# EAGLE design power_converter (EAGLE 9.0.0)
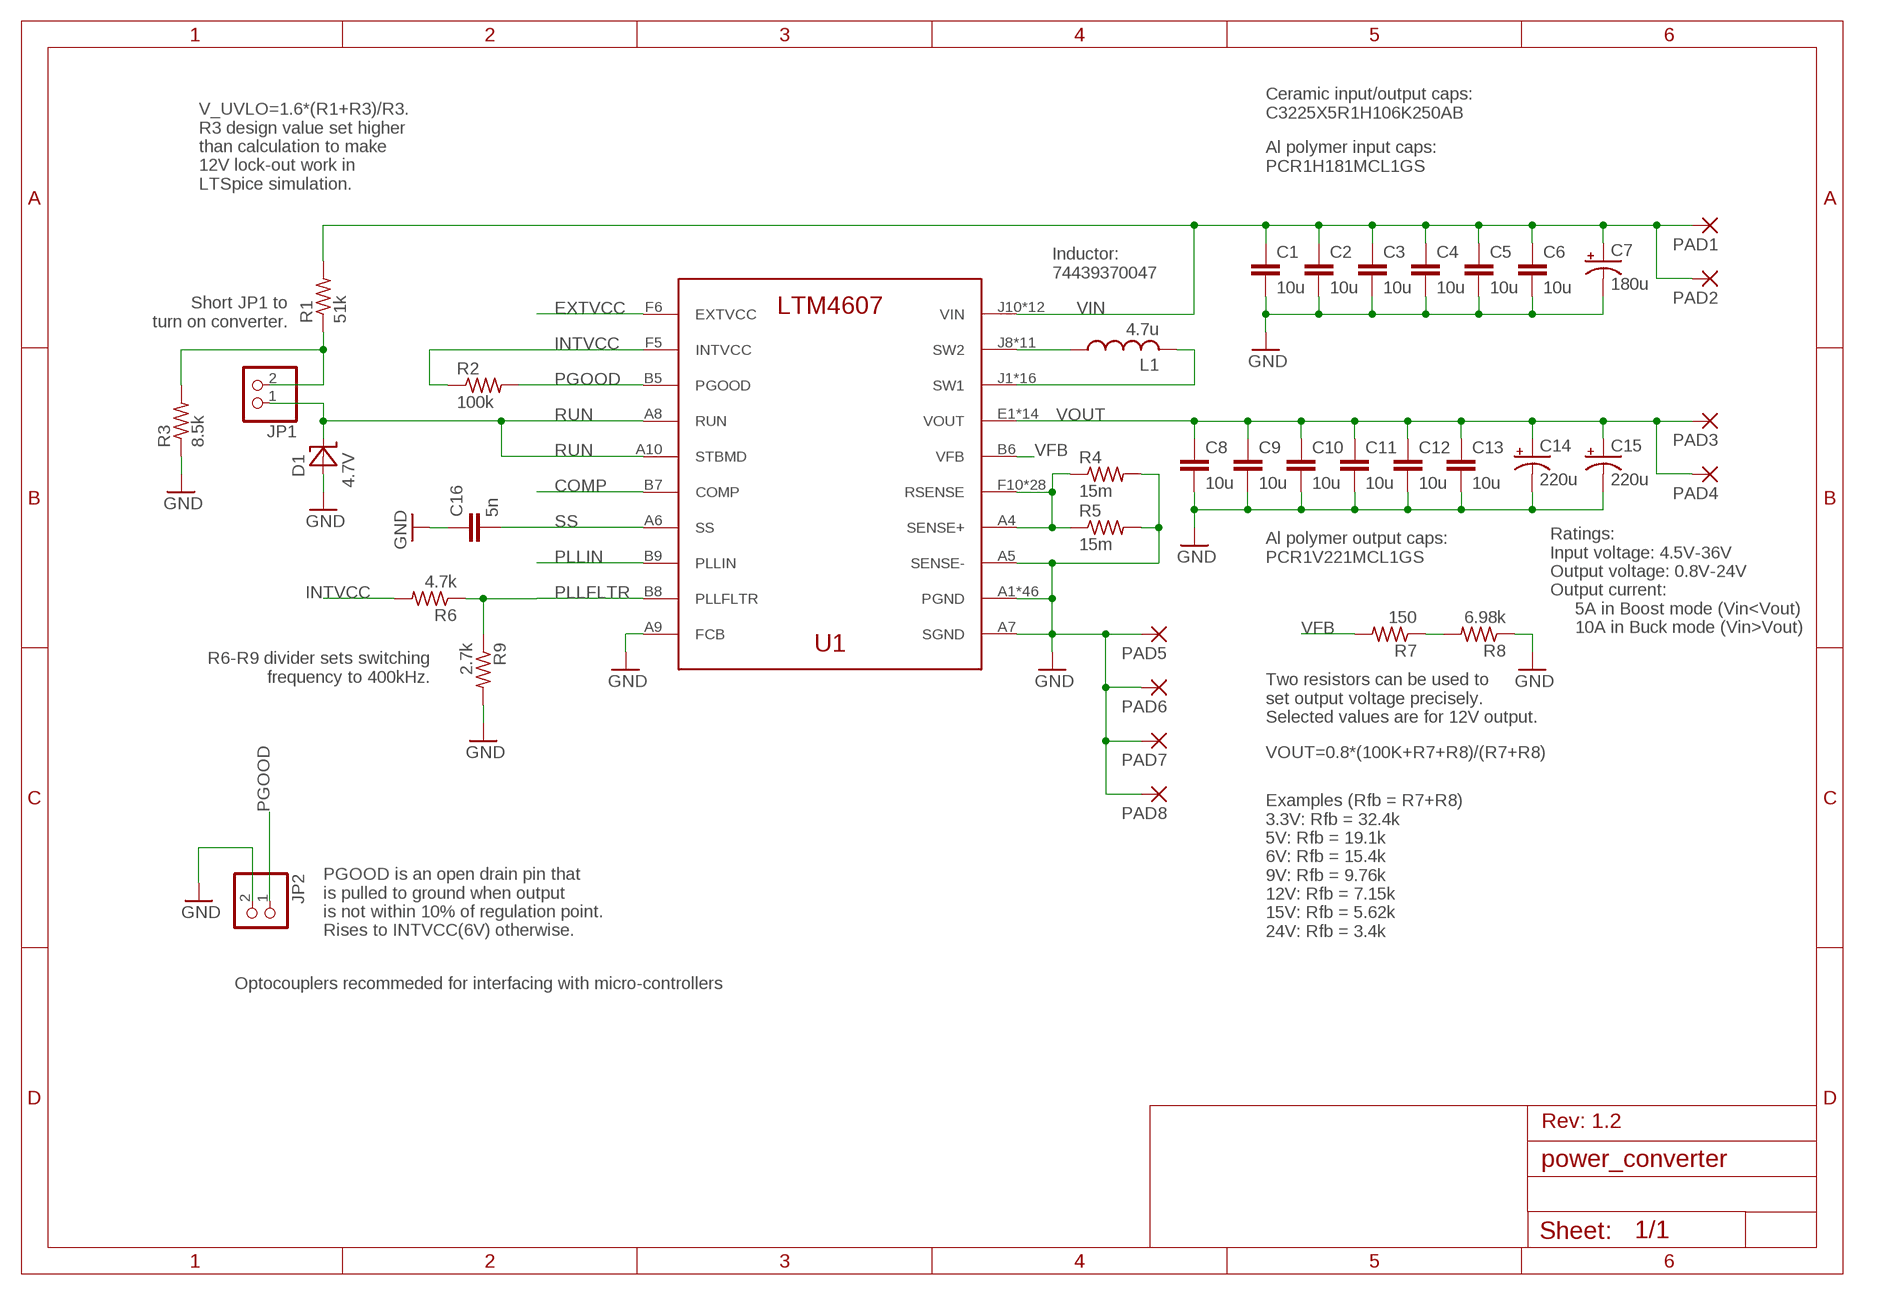
[diagram p0: schematic, sheet 1]

## Parts
C1  10u  C-EUC1210  [C1210]
C2  10u  C-EUC1210  [C1210]
C3  10u  C-EUC1210  [C1210]
C4  10u  C-EUC1210  [C1210]
C5  10u  C-EUC1210  [C1210]
C6  10u  C-EUC1210  [C1210]
C7  180u  PCR1H181MCL1GS  [PCR1H181MCL1GS]
C8  10u  C-EUC1210  [C1210]
C9  10u  C-EUC1210  [C1210]
C10  10u  C-EUC1210  [C1210]
C11  10u  C-EUC1210  [C1210]
C12  10u  C-EUC1210  [C1210]
C13  10u  C-EUC1210  [C1210]
C14  220u  PCR1V221MCL1GS  [PCR1V221MCL1GS]
C15  220u  PCR1V221MCL1GS  [PCR1V221MCL1GS]
C16  5n  C-EUC0603  [C0603]
D1  4.7V  BZX84C4V7LT1G  [SOT23]
JP1  PINHD-1X02_2.54-SMD  [1X02SMD]
JP2  PINHD-1X02_2.54-SMD  [1X02SMD]
L1  4.7u  74439370047  [74439370047]
PAD1  3,81/1,5  [3,81/1,5]
PAD2  3,81/1,5  [3,81/1,5]
PAD3  3,81/1,5  [3,81/1,5]
PAD4  3,81/1,5  [3,81/1,5]
PAD5  3,81/1,5  [3,81/1,5]
PAD6  3,81/1,5  [3,81/1,5]
PAD7  3,81/1,5  [3,81/1,5]
PAD8  3,81/1,5  [3,81/1,5]
R1  51k  R-US_R0603  [R0603]
R2  100k  R-US_R0603  [R0603]
R3  8.5k  R-US_R0603  [R0603]
R4  15m  R-US_R1206  [R1206]
R5  15m  R-US_R1206  [R1206]
R6  4.7k  R-US_R0603  [R0603]
R7  150  R-US_R0603  [R0603]
R8  6.98k  R-US_R0603  [R0603]
R9  2.7k  R-US_R0603  [R0603]
U1  LTM4607EVPBF  [LGA-141]

## Nets
COMP: U1.B7(COMP)
EXTVCC: U1.F6(EXTVCC)
GND: C1.2 C2.2 C3.2 C4.2 C5.2 C6.2 C7.NEG(-) C8.2 C9.2 C10.2 C11.2 C12.2 C13.2 C14.NEG(-) C15.NEG(-) C16.1 D1.1(A) JP2.2 PAD5.1(P) PAD6.1(P) PAD7.1(P) PAD8.1(P) R3.1 R4.2 R5.2 R8.1 R9.2 U1.A1(PGND) U1.A2(PGND) U1.A3(PGND) U1.A5(SENSE-) U1.A7(SGND) U1.A9(FCB) U1.A11(PGND) U1.A12(PGND) U1.B1(PGND) U1.B2(PGND) U1.B3(PGND) U1.B4(PGND) U1.B10(PGND) U1.B11(PGND) U1.B12(PGND) U1.C1(PGND) U1.C2(PGND) U1.C3(PGND) U1.C4(PGND) U1.C5(PGND) U1.C6(PGND) U1.C7(PGND) U1.C8(PGND) U1.C9(PGND) U1.C10(PGND) U1.C11(PGND) U1.C12(PGND) U1.D1(PGND) U1.D2(PGND) U1.D3(PGND) U1.D4(PGND) U1.D5(PGND) U1.D6(PGND) U1.D7(PGND) U1.D8(PGND) U1.D9(PGND) U1.D10(PGND) U1.D11(PGND) U1.D12(PGND) U1.E3(PGND) U1.E4(PGND) U1.E5(PGND) U1.E6(PGND) U1.E7(PGND) U1.E8(PGND) U1.E9(PGND) U1.E10(PGND) U1.E11(PGND) U1.E12(PGND)
INTVCC: R2.1 R6.2 U1.F5(INTVCC)
N$1: R7.1 R8.2
N$2: JP1.2 R1.1 R3.2
PGOOD: JP2.1 R2.2 U1.B5(PGOOD)
PLLFLTR: R6.1 R9.1 U1.B8(PLLFLTR)
PLLIN: U1.B9(PLLIN)
RSENSE: R4.1 R5.1 U1.A4(SENSE+) U1.F10(RSENSE) U1.F11(RSENSE) U1.F12(RSENSE) U1.G5(RSENSE) U1.G6(RSENSE) U1.G7(RSENSE) U1.G8(RSENSE) U1.G9(RSENSE) U1.G10(RSENSE) U1.G11(RSENSE) U1.G12(RSENSE) U1.H5(RSENSE) U1.H6(RSENSE) U1.H7(RSENSE) U1.H8(RSENSE) U1.H9(RSENSE) U1.H10(RSENSE) U1.H11(RSENSE) U1.H12(RSENSE) U1.J5(RSENSE) U1.J6(RSENSE) U1.J7(RSENSE) U1.K5(RSENSE) U1.K6(RSENSE) U1.L5(RSENSE) U1.L6(RSENSE) U1.M5(RSENSE) U1.M6(RSENSE)
RUN: D1.3(C) JP1.1 U1.A8(RUN) U1.A10(STBMD)
SS: C16.2 U1.A6(SS)
SW1: L1.M2 U1.J1(SW1) U1.J2(SW1) U1.J3(SW1) U1.J4(SW1) U1.K1(SW1) U1.K2(SW1) U1.K3(SW1) U1.K4(SW1) U1.L1(SW1) U1.L2(SW1) U1.L3(SW1) U1.L4(SW1) U1.M1(SW1) U1.M2(SW1) U1.M3(SW1) U1.M4(SW1)
SW2: L1.M1 U1.J8(SW2) U1.J9(SW2) U1.K7(SW2) U1.K8(SW2) U1.K9(SW2) U1.L7(SW2) U1.L8(SW2) U1.L9(SW2) U1.M7(SW2) U1.M8(SW2) U1.M9(SW2)
VFB: R7.2 U1.B6(VFB)
VIN: C1.1 C2.1 C3.1 C4.1 C5.1 C6.1 C7.POS(+) PAD1.1(P) PAD2.1(P) R1.2 U1.J10(VIN) U1.J11(VIN) U1.J12(VIN) U1.K10(VIN) U1.K11(VIN) U1.K12(VIN) U1.L10(VIN) U1.L11(VIN) U1.L12(VIN) U1.M10(VIN) U1.M11(VIN) U1.M12(VIN)
VOUT: C8.1 C9.1 C10.1 C11.1 C12.1 C13.1 C14.POS(+) C15.POS(+) PAD3.1(P) PAD4.1(P) U1.E1(VOUT) U1.E2(VOUT) U1.F1(VOUT) U1.F2(VOUT) U1.F3(VOUT) U1.F4(VOUT) U1.G1(VOUT) U1.G2(VOUT) U1.G3(VOUT) U1.G4(VOUT) U1.H1(VOUT) U1.H2(VOUT) U1.H3(VOUT) U1.H4(VOUT)

## Notes on the sheet
- Ceramic input/output caps:
  C3225X5R1H106K250AB
- Al polymer input caps:
  PCR1H181MCL1GS
- V_UVLO=1.6*(R1+R3)/R3.
  R3 design value set higher 
  than calculation to make
  12V lock-out work in
  LTSpice simulation.
- Inductor:
  74439370047
- Short JP1 to
  turn on converter.
- Ratings:
  Input voltage: 4.5V-36V
  Output voltage: 0.8V-24V
  Output current:
       5A in Boost mode (Vin<Vout)
       10A in Buck mode (Vin>Vout)
- Al polymer output caps:
  PCR1V221MCL1GS
- R6-R9 divider sets switching
  frequency to 400kHz.
- Two resistors can be used to
  set output voltage precisely.
  Selected values are for 12V output.
- VOUT=0.8*(100K+R7+R8)/(R7+R8)
- Examples (Rfb = R7+R8)
  3.3V: Rfb = 32.4k
  5V: Rfb = 19.1k
  6V: Rfb = 15.4k
  9V: Rfb = 9.76k
  12V: Rfb = 7.15k
  15V: Rfb = 5.62k
  24V: Rfb = 3.4k
- PGOOD is an open drain pin that
  is pulled to ground when output
  is not within 10% of regulation point.
  Rises to INTVCC(6V) otherwise.
- Optocouplers recommeded for interfacing with micro-controllers
- Rev: 1.2

## Library data of the parts
C1-C6 C8-C13 C16 = rcl:C-EU: CAPACITOR, European symbol; SPICEPREFIX: C
C7 = LTM4607:PCR1H181MCL1GS
C14 C15 = LTM4607:PCR1V221MCL1GS
D1 = LTM4607:BZX84C4V7LT1G
JP1 JP2 = pinhead-2:PINHD-1X02: PIN HEADER
L1 = LTM4607:74439370047
PAD1-PAD8 = LTM4607:3,81/1,5: THROUGH-HOLE PAD
R1-R9 = rcl:R-US_: RESISTOR, American symbol; SPICEPREFIX: R
U1 = LTM4607:LTM4607EVPBF; MANUFACTURER_PART_NUMBER: LTM4607EV#PBF; VENDOR: Linear Technology

## Board
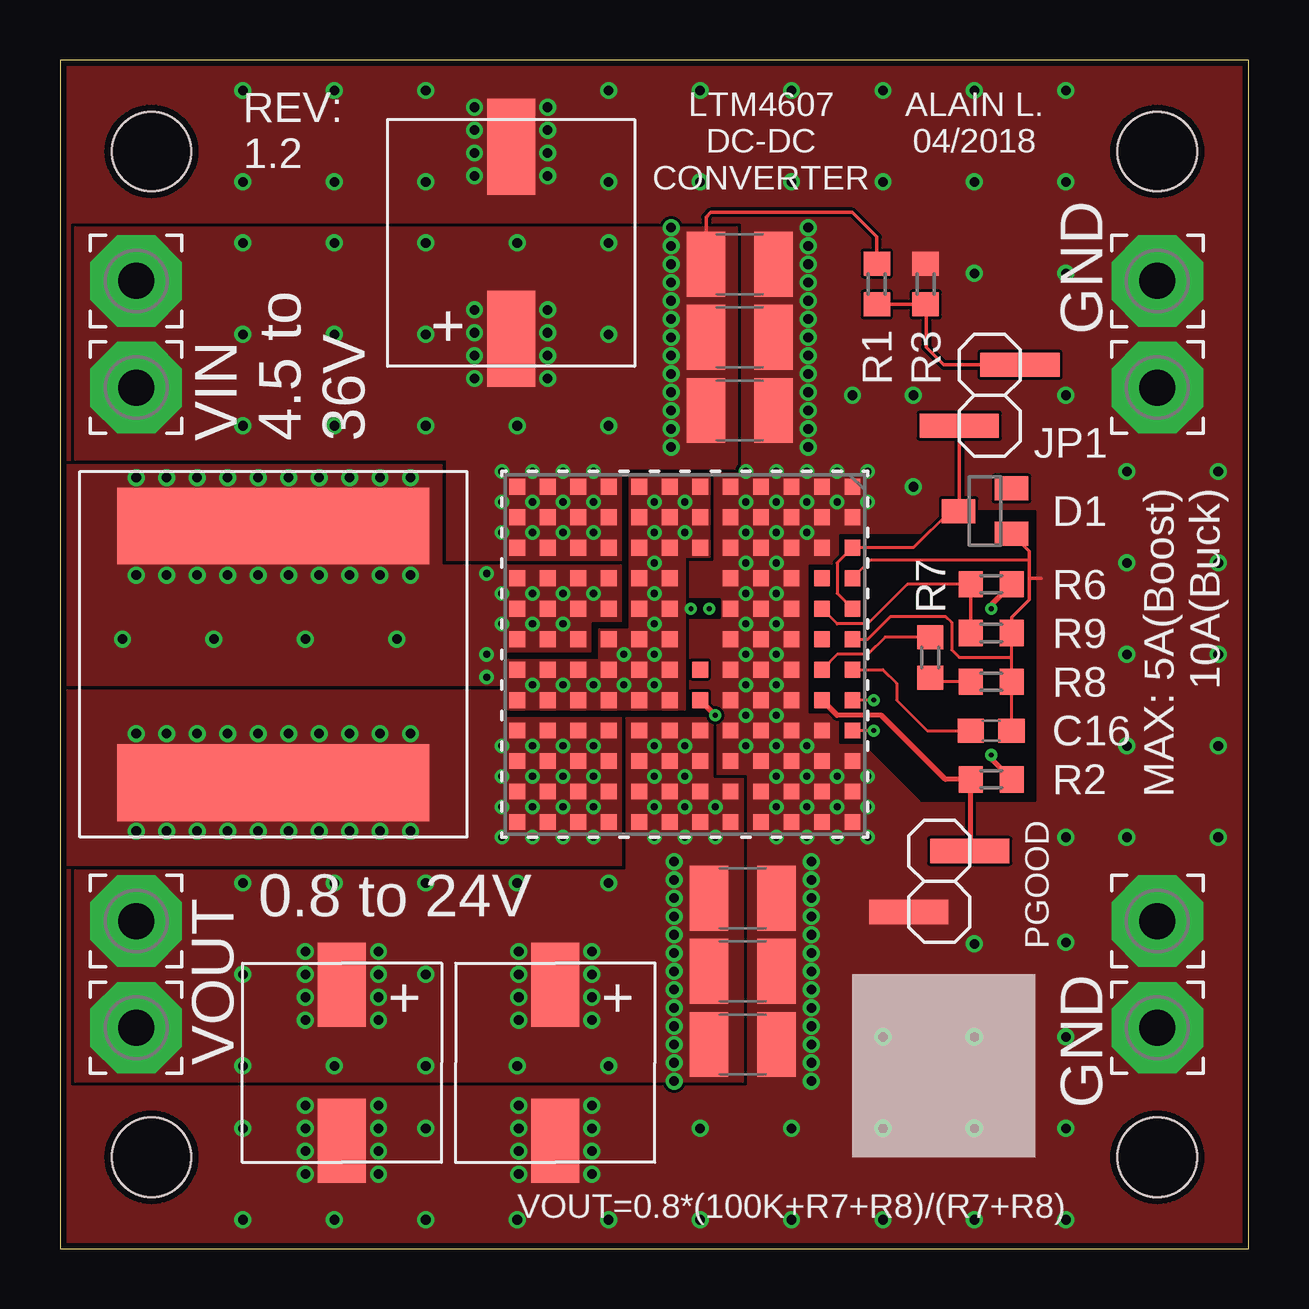
[diagram p1: board, top side]
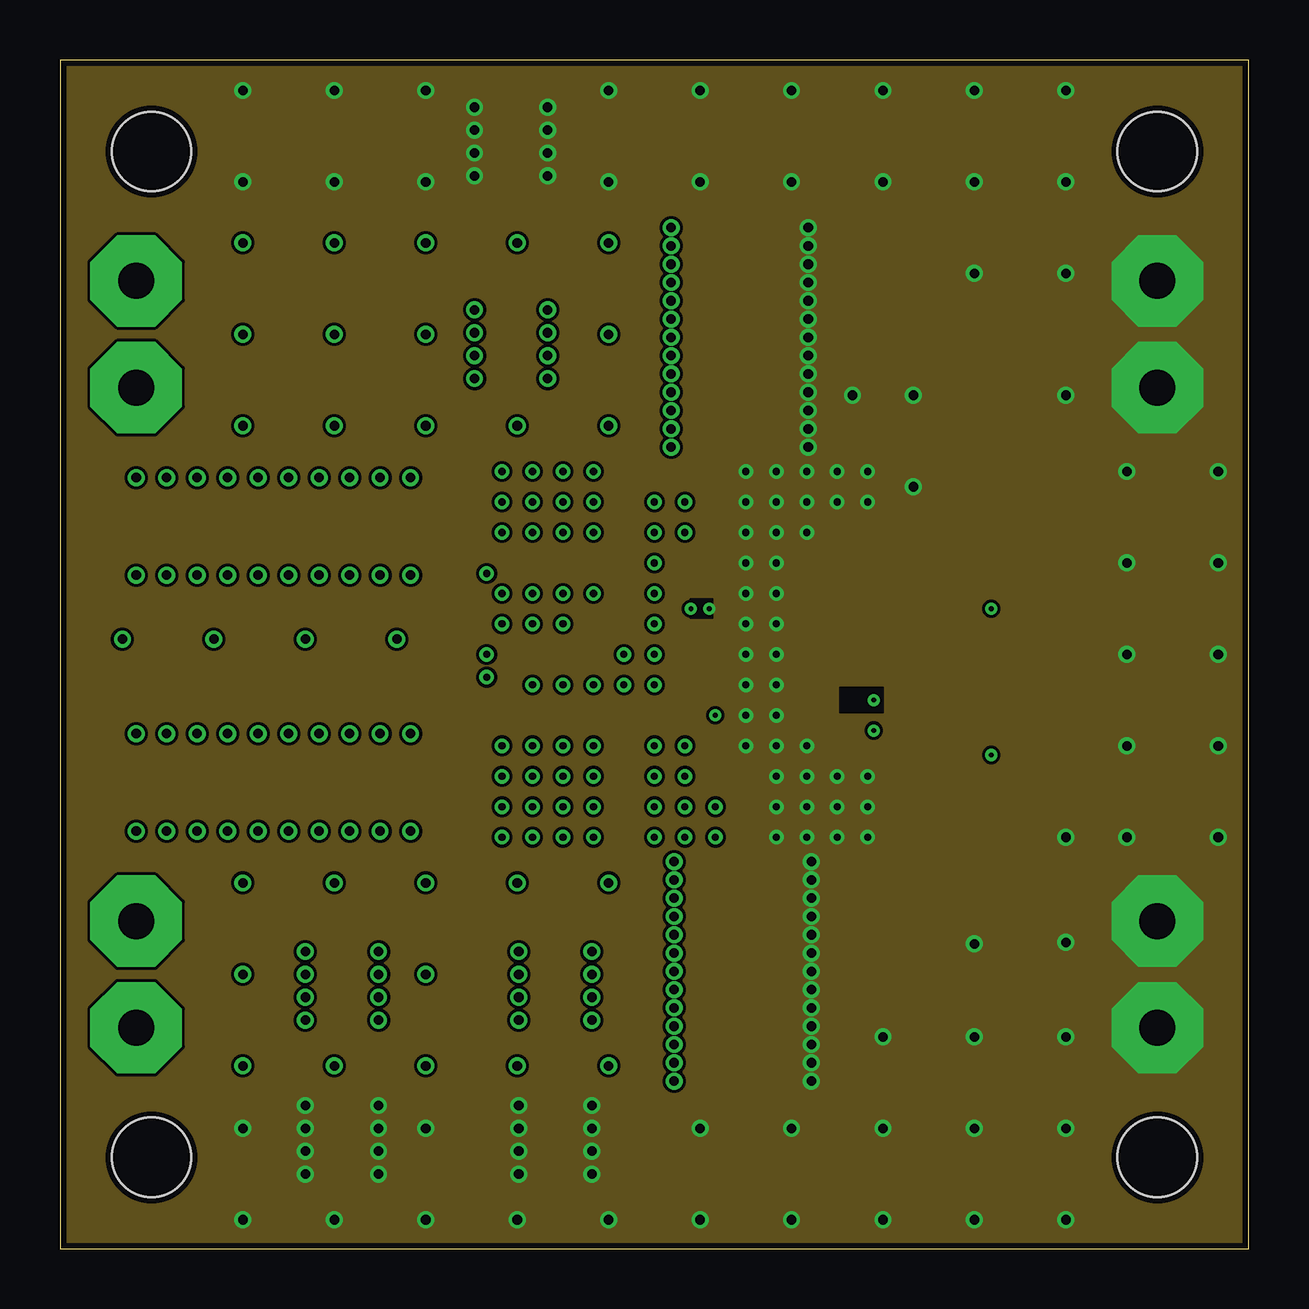
[diagram p2: board, inner layer Route2]
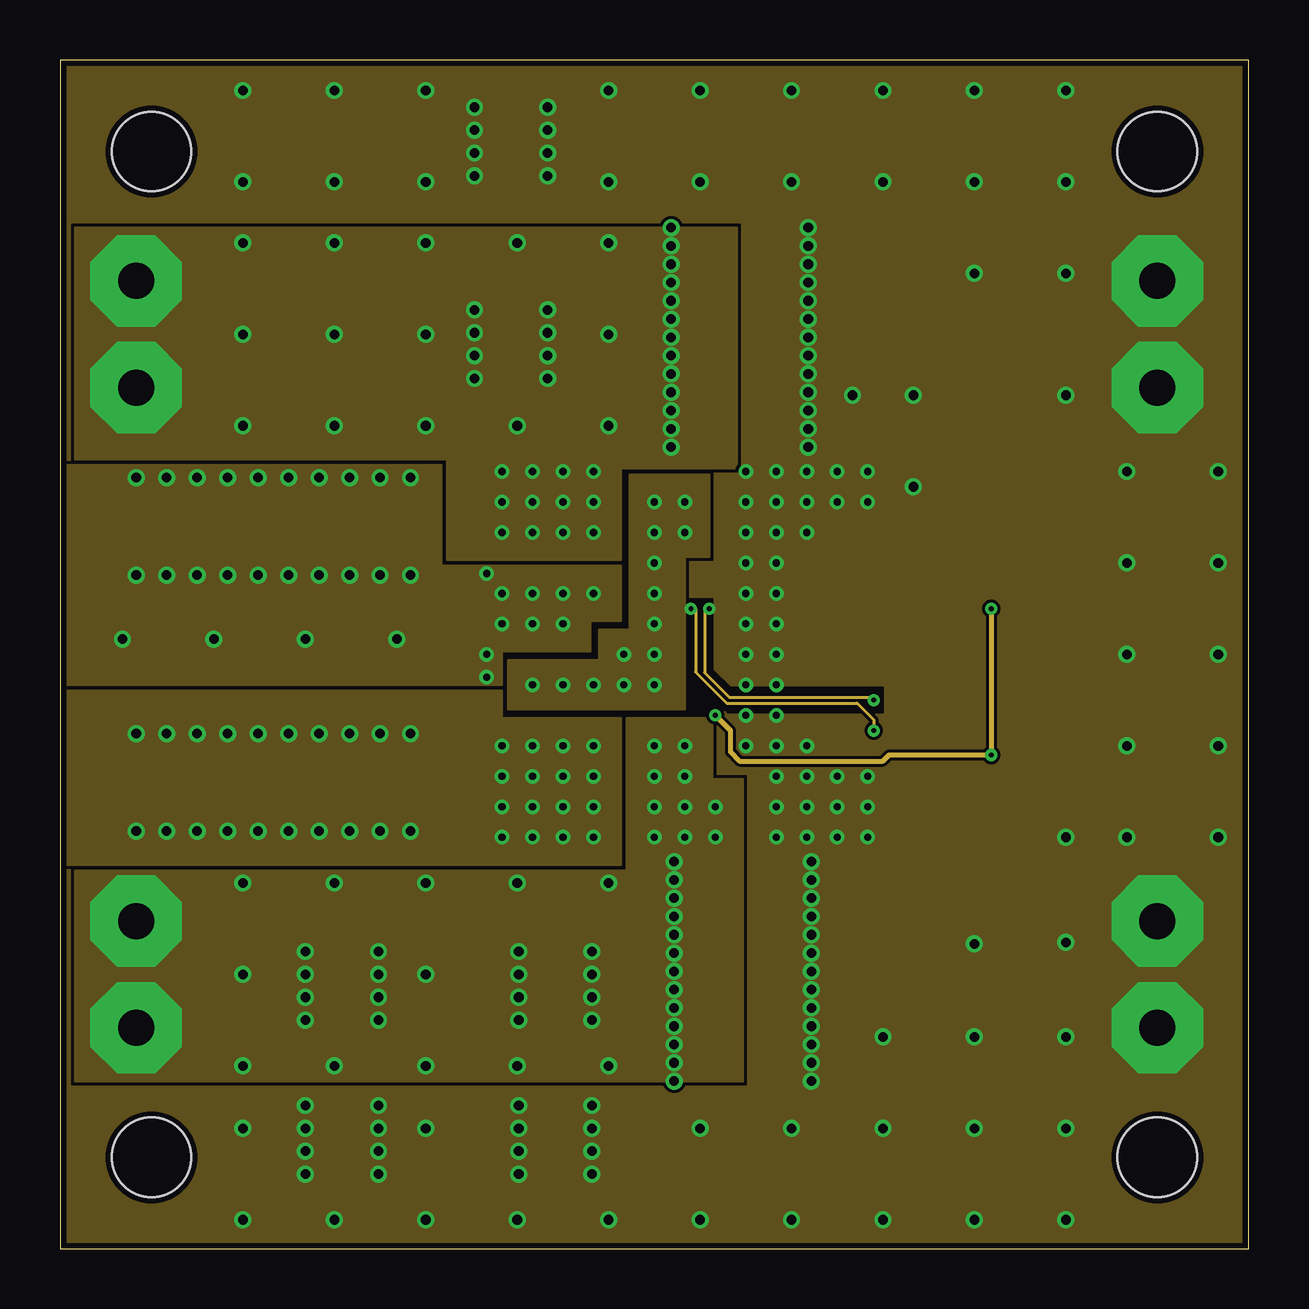
[diagram p3: board, inner layer Route15]
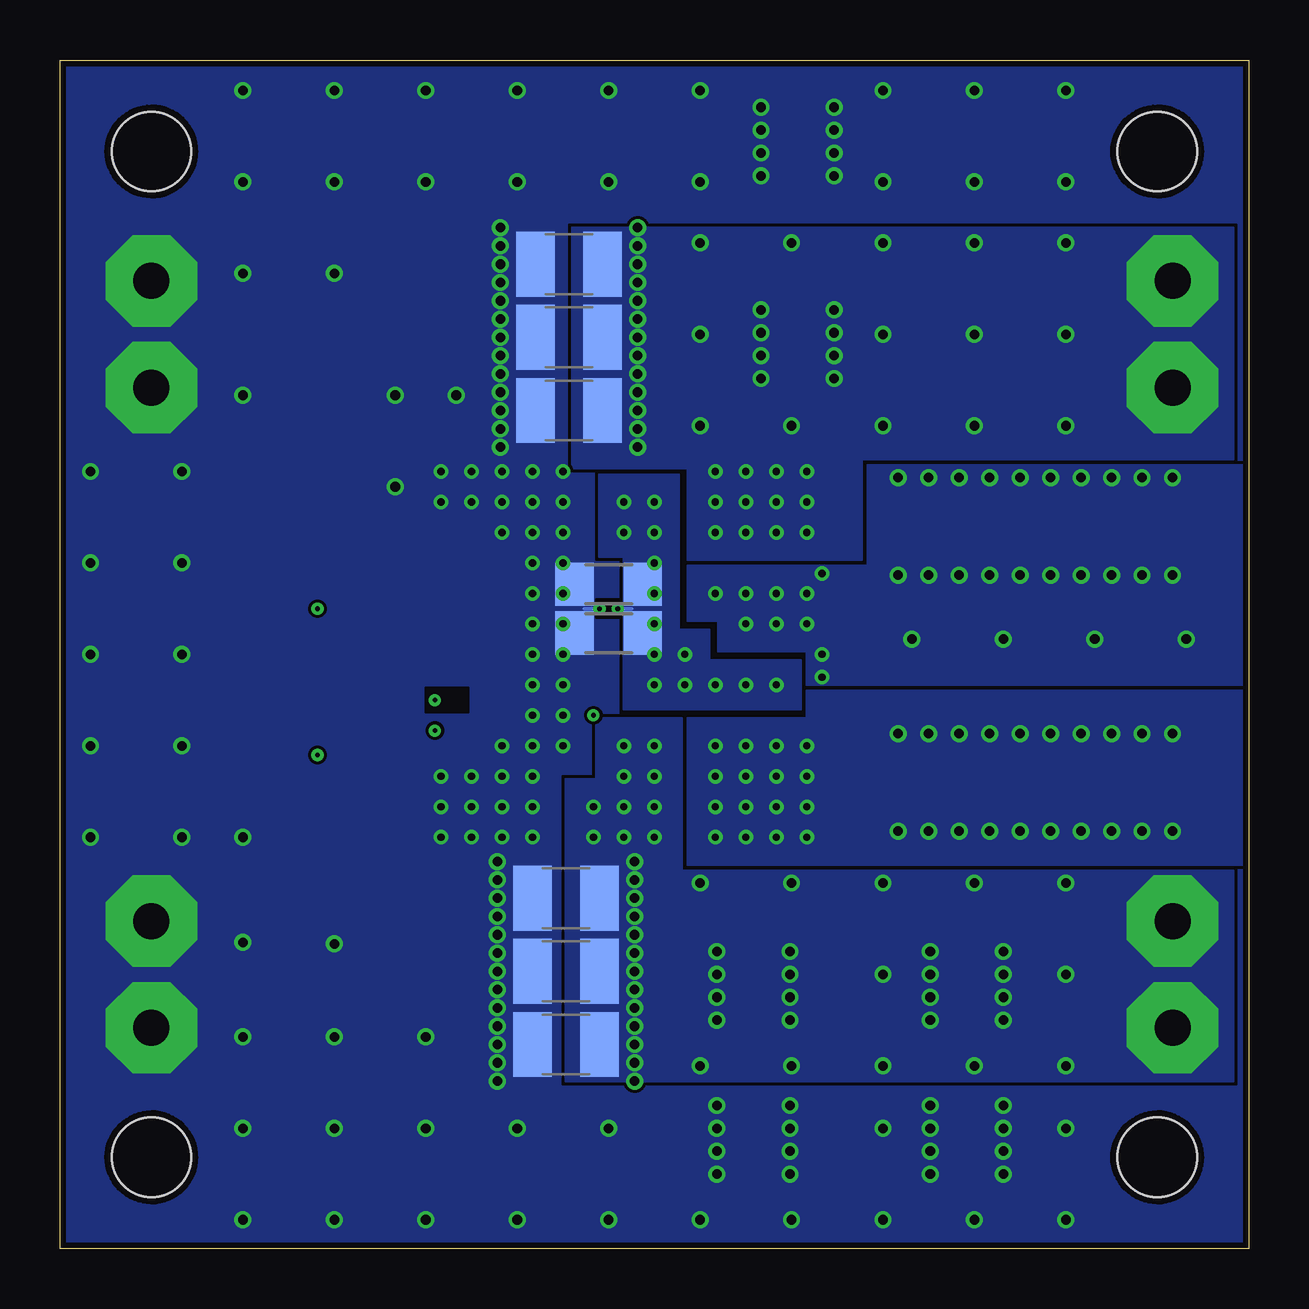
[diagram p4: board, bottom side, seen from below]

Size 49.53 x 49.53 mm. Coordinates in mm from the lower left corner, seen from the top.
Outline: 0,0 49.53,0 49.53,49.53 0,49.53 0,0
Copper layers (1*2*15*16): Top 0.035mm / dielectric 0.1702mm / Route2 0.0175mm / dielectric 47mil / Route15 0.0175mm / dielectric 0.1702mm / Bottom 0.035mm
Design rules "JLCPCB4Layer *": minimum track width 3.5mil, minimum drill 0.2mm, track to track 5mil, track to pad 5mil, pad to pad 5mil, via to via 5mil, smd to smd 0mil, copper to edge 10mil, drill to drill 10mil, minimum pad ring 6mil, minimum via ring 6mil, stop-mask expansion 2mil, vias tented up to drill 100mil, thermal gap 10mil

### Footprints (pad centres in the part's own frame; a part is rotated, then mirrored left to right if it is on the bottom)
C1210 = smd 1.6 x 2.7: 1 -1.4,0; 2 1.4,0
PCR1H181MCL1GS = smd 2 x 4: NEG 0,-4; POS 0,4
PCR1V221MCL1GS = smd 2 x 3.5: NEG 0,-3.25; POS 0,3.25
C0603 = smd 1.1 x 1: 1 -0.85,0; 2 0.85,0
SOT23 = smd 1 x 1.4: 1 -0.95,-1.1; 2 0.95,-1.1; 3 0,1.1
1X02SMD = smd 1.016 x 3.302: 1 -1.27,1.27; 2 1.27,-1.27
74439370047 = smd 13 x 3.2: M1 0,5.35; M2 0,-5.35
3,81/1,5 = drill 1.5 pad 3.81 octagon: 1 0,0
R0603 = smd 1 x 1.1: 1 -0.85,0; 2 0.85,0
R1206 = smd 1.6 x 1.803: 1 -1.422,0; 2 1.422,0
LGA-141 = smd 0.66 x 0.66: A1 6.985,6.985; A2 5.715,6.985; A3 4.445,6.985; A4 3.175,6.985; A5 1.905,6.985; A6 0.635,6.985; A7 -0.635,6.985; A8 -1.905,6.985; A9 -3.175,6.985; A10 -4.445,6.985; A11 -5.715,6.985; A12 -6.985,6.985; B1 6.985,5.715; B2 5.715,5.715; B3 4.445,5.715; B4 3.175,5.715; B5 1.905,5.715; B6 0.635,5.715; B7 -0.635,5.715; B8 -1.905,5.715; B9 -3.175,5.715; B10 -4.445,5.715; B11 -5.715,5.715; B12 -6.985,5.715; C1 6.985,4.445; C2 5.715,4.445; C3 4.445,4.445; C4 3.175,4.445; C5 1.905,4.445; C6 0.635,4.445; C7 -0.635,4.445; C8 -1.905,4.445; C9 -3.175,4.445; C10 -4.445,4.445; C11 -5.715,4.445; C12 -6.985,4.445; D1 6.985,3.175; D2 5.715,3.175; D3 4.445,3.175; D4 3.175,3.175; D5 1.905,3.175; D6 0.635,3.175; D7 -0.635,3.175; D8 -1.905,3.175; D9 -3.175,3.175; D10 -4.445,3.175; D11 -5.715,3.175; D12 -6.985,3.175; E1 6.985,1.905; E2 5.715,1.905; E3 4.445,1.905; E4 3.175,1.905; E5 1.905,1.905; E6 0.635,1.905; E7 -0.635,1.905; E8 -1.905,1.905; E9 -3.175,1.905; E10 -4.445,1.905; E11 -5.715,1.905; E12 -6.985,1.905; F1 6.985,0.635; F2 5.715,0.635; F3 4.445,0.635; F4 3.175,0.635; F5 1.905,0.635; F6 0.635,0.635; F10 -4.445,0.635; F11 -5.715,0.635; F12 -6.985,0.635; G1 6.985,-0.635; G2 5.715,-0.635; G3 4.445,-0.635; G4 3.175,-0.635; G5 1.905,-0.635; G6 0.635,-0.635; G7 -0.635,-0.635; G8 -1.905,-0.635; G9 -3.175,-0.635; G10 -4.445,-0.635; G11 -5.715,-0.635; G12 -6.985,-0.635; H1 6.985,-1.905; H2 5.715,-1.905; H3 4.445,-1.905; H4 3.175,-1.905; H5 1.905,-1.905; H6 0.635,-1.905; H7 -0.635,-1.905; H8 -1.905,-1.905; H9 -3.175,-1.905; H10 -4.445,-1.905; H11 -5.715,-1.905; H12 -6.985,-1.905; J1 6.985,-3.175; J2 5.715,-3.175; J3 4.445,-3.175; J4 3.175,-3.175; J5 1.905,-3.175; J6 0.635,-3.175; J7 -0.635,-3.175; J8 -1.905,-3.175; J9 -3.175,-3.175; J10 -4.445,-3.175; J11 -5.715,-3.175; J12 -6.985,-3.175; K1 6.985,-4.445; K2 5.715,-4.445; K3 4.445,-4.445; K4 3.175,-4.445; K5 1.905,-4.445; K6 0.635,-4.445; K7 -0.635,-4.445; K8 -1.905,-4.445; K9 -3.175,-4.445; K10 -4.445,-4.445; K11 -5.715,-4.445; K12 -6.985,-4.445; L1 6.985,-5.715; L2 5.715,-5.715; L3 4.445,-5.715; L4 3.175,-5.715; L5 1.905,-5.715; L6 0.635,-5.715; L7 -0.635,-5.715; L8 -1.905,-5.715; L9 -3.175,-5.715; L10 -4.445,-5.715; L11 -5.715,-5.715; L12 -6.985,-5.715; M1 6.985,-6.985; M2 5.715,-6.985; M3 4.445,-6.985; M4 3.175,-6.985; M5 1.905,-6.985; M6 0.635,-6.985; M7 -0.635,-6.985; M8 -1.905,-6.985; M9 -3.175,-6.985; M10 -4.445,-6.985; M11 -5.715,-6.985; M12 -6.985,-6.985
STAND-OFF = hole 3.302: 0,0

### Placement (x,y rotation side)
C1  28.32,37.97 180 bottom
C2  28.32,34.92 180 bottom
C3  28.32,37.97 0 top
C4  28.32,34.92 0 top
C5  28.32,41.02 180 bottom
C6  28.32,41.02 0 top
C7  18.8,41.91 180 top
C8  28.45,14.61 0 top
C9  28.45,11.56 180 bottom
C10  28.45,14.61 180 bottom
C11  28.45,11.56 0 top
C12  28.45,8.51 180 bottom
C13  28.45,8.51 0 top
C14  20.64,7.75 0 top
C15  11.75,7.75 0 top
C16  38.8,21.59 180 top
D1  38.54,30.73 90 top
JP1  38.73,35.56 90 top
JP2  36.64,15.3 270 top
L1  8.89,24.77 0 top
PAD1  3.17,35.88 90 top
PAD2  3.17,40.32 0 top
PAD3  3.17,13.65 90 top
PAD4  3.17,9.21 0 top
PAD5  45.72,9.21 90 top
PAD6  45.72,40.32 90 top
PAD7  45.72,13.65 0 top
PAD8  45.72,35.88 0 top
R1  34.04,40.2 90 top
R2  38.8,19.56 180 top
R3  36.07,40.2 270 top
R4  26.67,27.69 180 bottom
R5  26.67,25.65 180 bottom
R6  38.8,27.69 0 top
R7  36.26,24.64 90 top
R8  38.8,23.62 180 top
R9  38.8,25.65 0 top
U1  26.04,24.77 270 top
U$1  [STAND-OFF]  45.72,3.81 0 top
U$2  [STAND-OFF]  3.81,3.81 0 top
U$3  [STAND-OFF]  3.81,45.72 0 top
U$4  [STAND-OFF]  45.72,45.72 0 top
U$5  [A4L-LOC]  -104.14,-60.96 0 top  (outside the outline)

### Tracks (layer width: path | path; a pad name or v marks a point on that pad's centre or on a via)
GND  (via drill 0.2, 0.3, 0.4)
  Top 0.127: v33.91,22.86 U1.A5 | 39.65,24.64 R8.1 C16.1 | 39.65,24.64 R9.2 | U1.A9 33.78,28.7 40.38,28.7 | U1.A7 33.66,25.4 34.61,26.35 36.89,26.35 37.15,26.1 37.15,24.96 37.47,24.64 39.65,24.64
  Top 0.152: R9.2 39.65,26.31 40.38,27.04 40.38,27.94 | D1.1 40.38,29.05 40.38,28.7 40.38,27.94 | 40.38,27.94 40.89,27.94
  Route15 0.127: v27.05,26.67 26.86,26.67 26.86,24 27.88,22.99 33.78,22.99 v33.91,22.86
  Bottom 0.152: v27.05,26.67 27.69,26.67
  other vias: 28.57,31.11 29.84,31.11 31.11,31.11 32.38,31.11 28.57,29.84 28.57,28.57 28.57,27.3 28.57,26.04 28.57,24.77 28.57,23.5 28.57,22.23 28.57,20.95 29.84,18.41 29.84,19.68 29.84,20.95 29.84,22.23 29.84,23.5 29.84,24.77 29.84,26.04 29.84,27.3 29.84,28.57 29.84,29.84 31.11,29.84 31.11,20.95 31.11,19.68 31.11,18.41 32.38,18.41 32.38,19.68 28.57,32.38 29.84,32.38 31.11,32.38 32.38,32.38 33.66,31.11 33.66,32.38 29.84,17.14 32.38,17.14 33.66,17.14 33.66,18.41 33.66,19.68 48.26,32.38 31.11,17.14 17.27,45.66 17.27,44.7 17.27,46.61 17.27,47.56 20.32,45.66 20.32,44.7 20.32,46.61 20.32,47.56 22.16,5.02 22.16,5.97 22.16,4.06 22.16,3.11 19.11,5.02 19.11,5.97 19.11,4.06 19.11,3.11 13.27,5.02 13.27,5.97 13.27,4.06 13.27,3.11 10.22,5.02 10.22,5.97 10.22,4.06 10.22,3.11 31.31,15.37 31.31,14.61 31.31,13.84 31.31,13.08 31.31,16.13 31.31,12.32 31.31,11.56 31.31,10.79 31.31,10.03 31.31,9.27 31.31,8.51 31.31,7.75 31.31,6.99 31.18,41.78 31.18,41.02 31.18,40.26 31.18,39.5 31.18,42.55 31.18,38.73 31.18,37.97 31.18,37.21 31.18,36.45 31.18,35.69 31.18,34.92 31.18,34.16 31.18,33.4 44.45,32.38 44.45,28.57 48.26,28.57 44.45,24.77 48.26,24.77 48.26,20.95 48.26,17.14 44.45,17.14 44.45,20.95 41.91,17.14 41.91,12.76 38.1,12.7 41.91,48.26 38.1,48.26 34.29,48.26 30.48,48.26 26.67,48.26 22.86,48.26 7.62,48.26 15.24,48.26 11.43,48.26 7.62,44.45 11.43,44.45 15.24,44.45 22.86,44.45 26.67,44.45 30.48,44.45 34.29,44.45 38.1,44.45 41.91,44.45 38.1,40.64 41.91,40.64 41.91,35.56 38.1,8.83 41.91,8.83 34.29,8.83 34.29,5.02 38.1,5.02 38.1,1.21 34.29,1.21 41.91,5.02 41.91,1.21 30.48,5.02 30.48,1.21 26.67,1.21 26.67,5.02 22.86,1.21 19.05,1.21 15.24,1.21 11.43,1.21 7.62,1.21 7.62,5.02 15.24,5.02 33.02,35.56 35.56,31.75 35.56,35.56
  cutout Route15: 27.18,27.05 26.29,27.05 26.29,23.88 27.81,22.35 34.29,22.35 34.29,23.37 27.94,23.37 27.18,24.13
  pour Route15 (rank 3, no thermals): 0,0 0,49.53 49.53,49.53 49.53,0
  pour Top (rank 3, no thermals): 0,0 0,49.53 49.53,49.53 49.53,0
  cutout Top: 34.29,22.35 34.29,23.37 32.51,23.37 32.51,22.35
  cutout Bottom: 34.29,22.35 34.29,23.37 32.51,23.37 32.51,22.35
  cutout Route2: 34.29,22.35 34.29,23.37 32.51,23.37 32.51,22.35
  pour Route2 (rank 3, no thermals): 0,0 0,49.53 49.53,49.53 49.53,0
  pour Bottom (rank 3, no thermals): 0,0 0,49.53 49.53,49.53 49.53,0
  cutout Bottom (no thermals): 27.18,27.05 26.29,27.05 26.29,26.29 27.18,26.29
  cutout Top (no thermals): 40.64,18.67 40.64,30.73 36.83,30.73 36.83,29.72 32.51,29.72 32.51,28.45 31.24,28.45 31.24,22.35 32.51,22.35 32.51,21.08 33.46,21.08 35.88,18.67
  cutout Top (no thermals): 27.5,27.05 26.29,27.05 26.29,26.29 27.5,26.29
  cutout Route2 (no thermals): 27.18,27.05 26.29,27.05 26.29,26.29 27.18,26.29
INTVCC  (via drill 0.2)
  Top 0.203: v27.3,22.23 U1.F5 | R6.2 38.8,26.84 v38.8,26.67 | v38.8,20.57 38.8,20.41 R2.1
  Route15 0.203: v27.3,22.23 27.94,21.59 27.94,20.7 28.32,20.32 34.29,20.32 34.54,20.57 v38.8,20.57 v38.8,26.67
N$1
  Top 0.127: R8.2 36.42,23.62 R7.1
N$2
  Top 0.152: R1.1 R3.2 36.09,39.37 36.09,37.57 36.83,36.83 JP1.2
PGOOD
  Top 0.102: JP2.1 37.95,16.51
  Top 0.203: U1.B5 32.38,22.23 34.23,22.23 36.89,19.56 R2.2 37.95,16.51
PLLFLTR
  Top 0.127: R6.1 35.31,27.69 33.66,26.04 32.38,26.04 U1.B8
  Top 0.152: R6.1 R9.1
RSENSE  (via drill 0.2, 0.3)
  Top 0.127: v33.91,21.59 U1.A4
  Route15 0.127: v26.29,26.67 26.48,26.67 26.48,24.02 27.77,22.73 33.21,22.73 33.91,22.04 v33.91,21.59
  Bottom 0.152: v26.29,26.67 25.72,26.67
  other vias: 26.04,31.11 24.77,31.11 24.77,29.84 26.04,29.84 24.77,28.57 24.77,27.3 24.77,26.04 24.77,24.77 23.5,24.77 24.77,23.5 23.5,23.5 22.23,23.5 20.95,23.5 19.68,23.5
  pour Top (rank 2, no thermals): 18.67,22.48 26.04,22.48 26.04,28.83 27.05,28.83 27.05,32.26 23.75,32.26 23.75,25.78 22.48,25.78 22.48,24.51 18.67,24.51
  pour Bottom (rank 2, no thermals): 18.67,22.48 26.04,22.48 26.04,28.83 27.05,28.83 27.05,32.26 23.75,32.26 23.75,25.78 22.48,25.78 22.48,24.51 18.67,24.51
  pour Route15 (rank 2, no thermals): 18.67,22.48 26.04,22.48 26.04,28.83 27.05,28.83 27.05,32.26 23.75,32.26 23.75,25.78 22.48,25.78 22.48,24.51 18.67,24.51
RUN
  Top 0.127: D1.3 37.08,30.73 35.56,29.21 U1.A10 32.38,28.57 32.38,27.3 U1.A8
  Top 0.152: JP1.1 37.47,31.11 37.08,30.73
SS
  Top 0.127: U1.A6 34.29,24.13 34.86,23.56 34.86,22.86 36.13,21.59 C16.2
SW1  (via drill 0.3, 0.4)
  other vias: 14.61,21.46 13.34,21.46 12.06,21.46 10.79,21.46 9.53,21.46 8.26,21.46 6.99,21.46 5.71,21.46 4.45,21.46 3.17,21.46 3.17,17.4 4.45,17.4 5.71,17.4 6.99,17.4 8.26,17.4 9.53,17.4 10.79,17.4 12.06,17.4 13.34,17.4 14.61,17.4 19.68,20.95 20.95,20.95 22.23,20.95 22.23,19.68 20.95,19.68 19.68,19.68 19.68,18.41 20.95,18.41 22.23,18.41 18.41,18.41 18.41,19.68 18.41,20.95 18.41,17.14 19.68,17.14 20.95,17.14 22.23,17.14
  pour Top (no thermals): 23.37,16 0,16 0,23.24 18.41,23.24 18.41,22.1 23.37,22.1
  pour Bottom (no thermals): 23.37,16 0,16 0,23.24 18.41,23.24 18.41,22.1 23.37,22.1
  pour Route15 (no thermals): 23.37,16 0,16 0,23.24 18.41,23.24 18.41,22.1 23.37,22.1
SW2  (via drill 0.3, 0.4)
  other vias: 22.23,27.3 20.95,26.04 20.95,27.3 19.68,27.3 19.68,26.04 18.41,27.3 18.41,26.04 3.17,28.07 4.45,28.07 5.71,28.07 6.99,28.07 8.26,28.07 9.53,28.07 10.79,28.07 12.06,28.07 13.34,28.07 14.61,28.07 14.61,32.13 13.34,32.13 12.06,32.13 10.79,32.13 9.53,32.13 8.26,32.13 6.99,32.13 5.71,32.13 4.45,32.13 3.17,32.13 2.6,25.4 6.41,25.4 10.22,25.4 14.03,25.4 17.78,24.77 17.78,23.81 17.78,28.13
  pour Top (no thermals): 22.1,24.89 22.1,26.16 23.37,26.16 23.37,28.45 15.88,28.45 15.88,32.64 0,32.64 0,23.5 18.41,23.5 18.41,24.89
  pour Bottom (no thermals): 22.1,24.89 22.1,26.16 23.37,26.16 23.37,28.45 15.88,28.45 15.88,32.64 0,32.64 0,23.5 18.41,23.5 18.41,24.89
  pour Route15 (no thermals): 22.1,24.89 22.1,26.16 23.37,26.16 23.37,28.45 15.88,28.45 15.88,32.64 0,32.64 0,23.5 18.41,23.5 18.41,24.89
VFB
  Top 0.127: R7.2 34.38,25.49 33.66,24.77 32.38,24.77 U1.B6
VIN  (via drill 0.3, 0.4)
  Top 0.152: R1.2 34.04,42.16 33.02,43.18 27.11,43.18 26.92,42.99 C6.1
  other vias: 22.23,29.84 22.23,31.11 20.95,31.11 20.95,29.84 19.68,29.84 19.68,31.11 19.68,32.38 20.95,32.38 22.23,32.38 18.41,32.38 18.41,31.11 18.41,29.84 20.32,38.16 20.32,39.12 20.32,37.21 20.32,36.26 17.27,38.16 17.27,39.12 17.27,37.21 17.27,36.26 25.46,41.78 25.46,41.02 25.46,40.26 25.46,39.5 25.46,42.55 25.46,38.73 25.46,37.97 25.46,37.21 25.46,36.45 25.46,35.69 25.46,34.92 25.46,34.16 25.46,33.4 7.62,41.91 7.62,38.1 7.62,34.29 11.43,34.29 11.43,38.1 11.43,41.91 15.24,41.91 15.24,38.1 15.24,34.29 19.05,34.29 22.86,38.1 19.05,41.91 22.86,41.91 22.86,34.29
  pour Top (no thermals): 23.37,28.7 23.37,32.51 28.19,32.51 28.19,42.55 0.64,42.55 0.64,32.89 16.13,32.89 16.13,28.7
  pour Route15 (no thermals): 23.37,28.7 23.37,32.51 28.19,32.51 28.19,42.55 0.64,42.55 0.64,32.89 16.13,32.89 16.13,28.7
  pour Bottom (no thermals): 23.37,28.7 23.37,32.51 28.19,32.51 28.19,42.55 0.64,42.55 0.64,32.89 16.13,32.89 16.13,28.7
VOUT  (via drill 0.3, 0.4)
  other vias: 26.04,20.95 24.77,20.95 24.77,19.68 26.04,19.68 26.04,18.41 24.77,18.41 27.3,18.41 27.3,17.14 24.77,17.14 26.04,17.14 19.11,10.48 19.11,9.53 19.11,11.43 19.11,12.38 22.16,10.48 22.16,9.53 22.16,11.43 22.16,12.38 10.22,10.48 10.22,9.53 10.22,11.43 10.22,12.38 13.27,10.48 13.27,9.53 13.27,11.43 13.27,12.38 25.59,15.37 25.59,14.61 25.59,13.84 25.59,13.08 25.59,16.13 25.59,12.32 25.59,11.56 25.59,10.79 25.59,10.03 25.59,9.27 25.59,8.51 25.59,7.75 25.59,6.99 7.62,15.24 7.62,11.43 7.62,7.62 11.43,7.62 11.43,15.24 15.24,15.24 15.24,11.43 15.24,7.62 19.05,15.24 19.05,7.62 22.86,7.62 22.86,15.24
  pour Top (no thermals): 23.62,22.1 23.62,15.75 0.64,15.75 0.64,6.99 28.45,6.99 28.45,19.56 27.18,19.56 27.18,22.1
  pour Route15 (no thermals): 23.62,22.1 23.62,15.75 0.64,15.75 0.64,6.99 28.45,6.99 28.45,19.56 27.18,19.56 27.18,22.1
  pour Bottom (no thermals): 23.62,22.1 23.62,15.75 0.64,15.75 0.64,6.99 28.45,6.99 28.45,19.56 27.18,19.56 27.18,22.1

### Text on the board
tPlace: REV: / 1.2 | LTM4607 / DC-DC / CONVERTER | ALAIN L. / 04/2018 | GND | VIN / 4.5 to / 36V | MAX: 5A(Boost) / 10A(Buck) | PGOOD | VOUT | 0.8 to 24V | GND | VOUT=0.8*(100K+R7+R8)/(R7+R8)
Reference: Stencil and reflow soldering / are highly recommended for / this design | Filled silk-screen square to be used / for noting designed output voltage | Through-hole wirepads sized for / 18AWG wire | Mounting holes sized for 4-40 screws | 4 layer design